# EAGLE design Main Board (rev A) - hand solder (EAGLE 6.4)
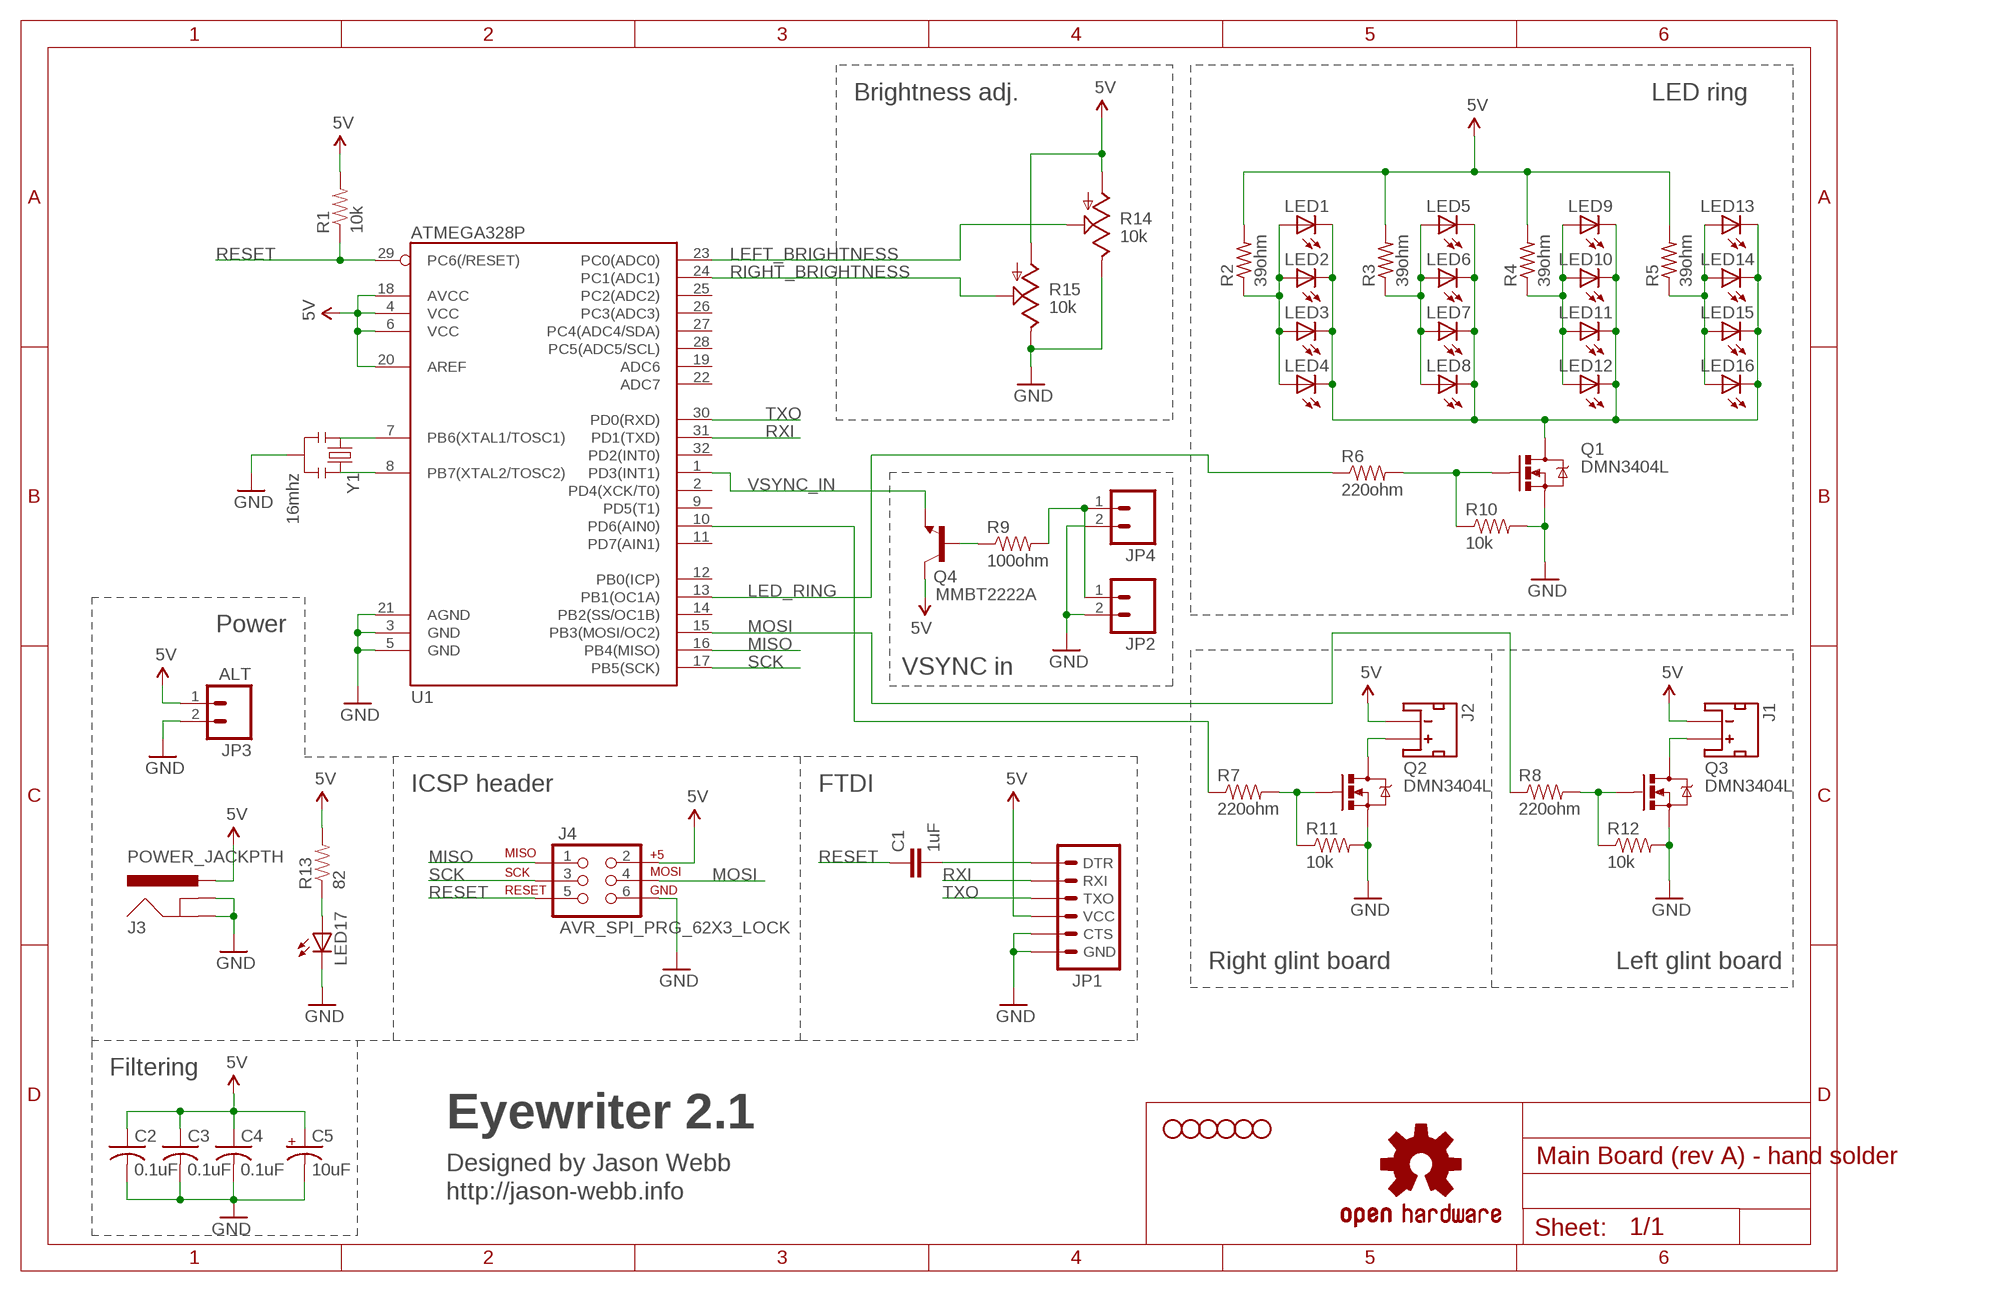
[diagram p0: schematic, sheet 1]

## Parts
C1  1uF  CAP0805  [0805]
C2  0.1uF  C-USC0805K  [C0805K]
C3  0.1uF  C-USC0805K  [C0805K]
C4  0.1uF  C-USC0805K  [C0805K]
C5  10uF  CPOL-USA/3216-18R  [A/3216-18R]
J1  JST_2MM_MALE  [JST-2-SMD]
J2  JST_2MM_MALE  [JST-2-SMD]
J3  POWER_JACKPTH  [POWER_JACK_PTH]
J4  AVR_SPI_PRG_62X3_LOCK  [2X3_LOCK]
JP1  ARDUINO_SERIAL_PROGRAMLOCK  [1X06_LOCK]
JP2  M02PTH  [1X02]
JP3  ALT  M02PTH  [1X02]
JP4  M02PTH  [1X02]
LED1  LED5MM  [LED5MM]
LED2  LED5MM  [LED5MM]
LED3  LED5MM  [LED5MM]
LED4  LED5MM  [LED5MM]
LED5  LED5MM  [LED5MM]
LED6  LED5MM  [LED5MM]
LED7  LED5MM  [LED5MM]
LED8  LED5MM  [LED5MM]
LED9  LED5MM  [LED5MM]
LED10  LED5MM  [LED5MM]
LED11  LED5MM  [LED5MM]
LED12  LED5MM  [LED5MM]
LED13  LED5MM  [LED5MM]
LED14  LED5MM  [LED5MM]
LED15  LED5MM  [LED5MM]
LED16  LED5MM  [LED5MM]
LED17  LEDCHIPLED_0805  [CHIPLED_0805]
LOGO1  OSHW-LOGOS  [OSHW-LOGO-S]
Q1  DMN3404L  MOSFET-NCHANNELSMD  [SOT23-3]
Q2  DMN3404L  MOSFET-NCHANNELSMD  [SOT23-3]
Q3  DMN3404L  MOSFET-NCHANNELSMD  [SOT23-3]
Q4  MMBT2222A  TRANSISTOR_NPNSOT23  [SOT23]
R1  10k  RESISTOR0805-RES  [0805]
R2  39ohm  R-US_0309/10  [0309/10]
R3  39ohm  R-US_0309/10  [0309/10]
R4  39ohm  R-US_0309/10  [0309/10]
R5  39ohm  R-US_0309/10  [0309/10]
R6  220ohm  RESISTOR0805-RES  [0805]
R7  220ohm  RESISTOR0805-RES  [0805]
R8  220ohm  RESISTOR0805-RES  [0805]
R9  100ohm  RESISTOR0805-RES  [0805]
R10  10k  RESISTOR0805-RES  [0805]
R11  10k  RESISTOR0805-RES  [0805]
R12  10k  RESISTOR0805-RES  [0805]
R13  82  RESISTOR0805-RES  [0805]
R14  10k  POT  [ALPS_POT]
R15  10k  POT  [ALPS_POT]
STANDOFF1  STAND-OFF  [STAND-OFF]
STANDOFF2  STAND-OFF  [STAND-OFF]
STANDOFF3  STAND-OFF  [STAND-OFF]
STANDOFF4  STAND-OFF  [STAND-OFF]
STANDOFF5  STAND-OFF  [STAND-OFF]
STANDOFF6  STAND-OFF  [STAND-OFF]
U1  ATMEGA328P  ATMEGA328_SMT  [TQFP32-08]
Y1  16mhz  RESONATORPTH  [RESONATOR-PTH]

## Nets
5V: C2.1 C3.1 C4.1 C5.+ J1.1(-) J2.1(-) J3.PWR J4.2 JP1.4(VCC) JP3.1 Q4.3(C) R1.2 R2.2 R3.2 R4.2 R5.2 R13.2 R14.P$3(A) R15.P$3(A) U1.4(VCC) U1.6(VCC) U1.18(AVCC) U1.20(AREF)
GLINT_RIGHT: R8.1 U1.15(PB3(MOSI/OC2))
GND: C2.2 C3.2 C4.2 C5.- J3.GND J3.GNDBREAK J4.6 JP1.5(CTS) JP1.6(GND) JP2.2 JP3.2 JP4.2 LED17.C Q1.2(S) Q2.2(S) Q3.2(S) R10.2 R11.2 R12.2 R14.P$1(E) R15.P$1(E) U1.3(GND) U1.5(GND) U1.21(AGND) Y1.2
LED_RING: R6.1 U1.13(PB1(OC1A))
LEFT_BRIGHTNESS: R14.P$2(S) U1.23(PC0(ADC0))
MISO: J4.1 U1.16(PB4(MISO))
MOSI: J4.4 R7.1 U1.10(PD6(AIN0))
N$1: LED17.A R13.1
N$2: U1.7(PB6(XTAL1/TOSC1)) Y1.1
N$3: U1.8(PB7(XTAL2/TOSC2)) Y1.3
N$4: LED1.A LED2.A LED3.A LED4.A R2.1
N$5: J2.2(+) Q2.3(D)
N$6: LED5.A LED6.A LED7.A LED8.A R3.1
N$7: Q1.1(G) R6.2 R10.1
N$8: LED9.A LED10.A LED11.A LED12.A R4.1
N$9: Q2.1(G) R7.2 R11.1
N$10: LED13.A LED14.A LED15.A LED16.A R5.1
N$11: J1.2(+) Q3.3(D)
N$12: JP2.1 JP4.1 R9.2
N$13: LED1.K(C) LED2.K(C) LED3.K(C) LED4.K(C) LED5.K(C) LED6.K(C) LED7.K(C) LED8.K(C) LED9.K(C) LED10.K(C) LED11.K(C) LED12.K(C) LED13.K(C) LED14.K(C) LED15.K(C) LED16.K(C) Q1.3(D)
N$14: Q3.1(G) R8.2 R12.1
N$15: Q4.1(B) R9.1
N$16: C1.2 JP1.1(DTR)
RESET: C1.1 J4.5 R1.1 U1.29(PC6(/RESET))
RIGHT_BRIGHTNESS: R15.P$2(S) U1.24(PC1(ADC1))
RXI: JP1.2(RXI) U1.31(PD1(TXD))
SCK: J4.3 U1.17(PB5(SCK))
TXO: JP1.3(TXO) U1.30(PD0(RXD))
VSYNC_IN: Q4.2(E) U1.1(PD3(INT1))
Unconnected: J1.NC1(PAD1) J1.NC2(PAD2) J2.NC1(PAD1) J2.NC2(PAD2) U1.2(PD4(XCK/T0)) U1.9(PD5(T1)) U1.11(PD7(AIN1)) U1.12(PB0(ICP)) U1.14(PB2(SS/OC1B)) U1.19(ADC6) U1.22(ADC7) U1.25(PC2(ADC2)) U1.26(PC3(ADC3)) U1.27(PC4(ADC4/SDA)) U1.28(PC5(ADC5/SCL)) U1.32(PD2(INT0))

## Notes on the sheet
- Brightness adj. | LED ring
- Power
- VSYNC in
- ICSP header | FTDI
- Right glint board | Left glint board
- Filtering
- Eyewriter 2.1
- Designed by Jason Webb
- http://jason-webb.info

## Library data of the parts
C1 = SparkFun-Capacitors:CAP: Capacitor Standard 0603 ceramic capacitor, and 0.1" leaded capacitor.
C2-C4 = adafruit:C-US: CAPACITOR, American symbol
C5 = adafruit:CPOL-US: POLARIZED CAPACITOR, American symbol
J1 J2 = SparkFun-Connectors:JST_2MM_MALE: Mates to single-cell LiPo batteries. CONN-08352; PROD_ID: CONN-08352
J3 = SparkFun-Connectors:POWER_JACK: Power Jack This is the standard 5.5mm barrel jack for power. The PTH is the most common, proven, reliable, footprint. The Slot footprint only works if the mill layer is transmitted to the PCB fab house so be warned. Spark Fun Electronics SKU : PRT-00119 SMT: CONN-08106 Mating wall wart : TOL-00298 (and others)
J4 = SparkFun-Connectors:AVR_SPI_PRG_6: AVR ISP 6 Pin This is the reduced ISP connector for AVR programming. Common on Arduino. This footprint will take up less PCB space and can be used with a 10-pin to 6-pin adapter such as SKU: BOB-08508
JP1 = SparkFun-Connectors:ARDUINO_SERIAL_PROGRAM: FTDI connector footprints
JP2-JP4 = SparkFun-Connectors:M02: Header 2 Standard 2-pin 0.1" header. Use with straight break away headers (SKU : PRT-00116), right angle break away headers (PRT-00553), swiss pins (PRT-00743), machine pins (PRT-00117), and female headers (PRT-00115). Molex polarized connector foot print use with SKU : PRT-08233 with associated crimp pins and housings.
LED1-LED16 = SparkFun-LED:LED: LEDs Standard schematic elements and footprints for 5mm, 3mm, 1206, and 0603 sized LEDs. 5mm - Spark Fun Electronics SKU : COM-00529 (and others)
LED17 = led:LED: LED OSRAM: - CHIPLED LG R971, LG N971, LY N971, LG Q971, LY Q971, LO R971, LY R971 LH N974, LH R974 LS Q976, LO Q976, LY Q976 LO Q996 - Hyper CHIPLED LW Q18S LB Q993, LB Q99A, LB R99A - SideLED LS A670, LO A670, LY A670, LG A670, LP A670 LB A673, LV A673, LT A673, LW A673 LH A674 LY A675 LS A676, LA A676, LO A676, LY A676, LW A676 LS A679, LY A679, LG A679 - Hyper Micro SIDELED® LS Y876, LA Y876, LO Y876, LY Y876 LT Y87S - SmartLED LW L88C, LW L88S LB L89C, LB L89S, LG L890 LS L89K, LO L89K, LY L89K LS L896, LA L896, LO L896, LY L896 - TOPLED LS T670, LO T670, LY T670, LG T670, LP T670 LSG T670, LSP T670, LSY T670, LOP T670, LYG T670 LG T671, LOG T671, LSG T671 LB T673, LV T673, LT T673, LW T673 LH T674 LS T676, LA T676, LO T676, LY T676, LB T676, LH T676, LSB T676, LW T676 LB T67C, LV T67C, LT T67C, LS T67K, LO T67K, LY T67K, LW E67C LS E67B, LA E67B, LO E67B, LY E67B, LB E67C, LV E67C, LT E67C LW T67C LS T679, LY T679, LG T679 LS T770, LO T770, LY T770, LG T770, LP T770 LB T773, LV T773, LT T773, LW T773 LH T774 LS E675, LA E675, LY E675, LS T675 LS T776, LA T776, LO T776, LY T776, LB T776 LHGB T686 LT T68C, LB T68C - Hyper Mini TOPLED® LB M676 - Mini TOPLED Santana® LG M470 LS M47K, LO M47K, LY M47K Source: http://www.osram.convergy.de LUXEON: - LUMILED® LXK2-PW12-R00, LXK2-PW12-S00, LXK2-PW14-U00, LXK2-PW14-V00 LXK2-PM12-R00, LXK2-PM12-S00, LXK2-PM14-U00 LXK2-PE12-Q00, LXK2-PE12-R00, LXK2-PE12-S00, LXK2-PE14-T00, LXK2-PE14-U00 LXK2-PB12-K00, LXK2-PB12-L00, LXK2-PB12-M00, LXK2-PB14-N00, LXK2-PB14-P00, LXK2-PB14-Q00 LXK2-PR12-L00, LXK2-PR12-M00, LXK2-PR14-Q00, LXK2-PR14-R00 LXK2-PD12-Q00, LXK2-PD12-R00, LXK2-PD12-S00 LXK2-PH12-R00, LXK2-PH12-S00 LXK2-PL12-P00, LXK2-PL12-Q00, LXK2-PL12-R00 Source: www.luxeon.com KINGBRIGHT: KA-3528ASYC Source: www.kingbright.com
LOGO1 = SparkFun-Aesthetics:OSHW-LOGO: Open Source Hardware Logo This logo indicates the piece of hardware it is found on incorporates a OSHW license and/or adheres to the definition of open source hardware found here: http://freedomdefined.org/OSHW
Q1-Q3 = SparkFun-DiscreteSemi:MOSFET-NCHANNEL: Generic NMOS footprint
Q4 = SparkFun-DiscreteSemi:TRANSISTOR_NPN: Generic NPN BJT. MMBT2222 is the common NPN we use. Double check against datasheet- not all devices are the same!
R1 R6-R13 = SparkFun-Resistors:RESISTOR: Resistor Basic schematic elements and footprints for 0603, 1206, and PTH resistors.
R2-R5 = resistor:R-US_: RESISTOR, American symbol
R14 R15 = SparkFun-Electromechanical:POT
STANDOFF1-STANDOFF6 = SparkFun-Electromechanical:STAND-OFF: #4 Stand Off This is the mechanical footprint for a #4 phillips button head screw. Use the keepout ring to avoid running the screw head into surrounding components. SKU : PRT-00447
U1 = SparkFun-DigitalIC:ATMEGA328_SMT: 32-Pin Atmega328 part Commonly used on Arduino compatible boards Available in QFP and QFN packages TQFP is IC-09069 QFN is non-stock; PROD_ID: IC-09069
Y1 = SparkFun-FreqCtrl:RESONATOR: Resonator Small SMD resonator. Used, eg, on the Arduino Pro/ Pro Mini boards. 8MHz- XTAL-08895 16MHz- XTAL-08900

## Board
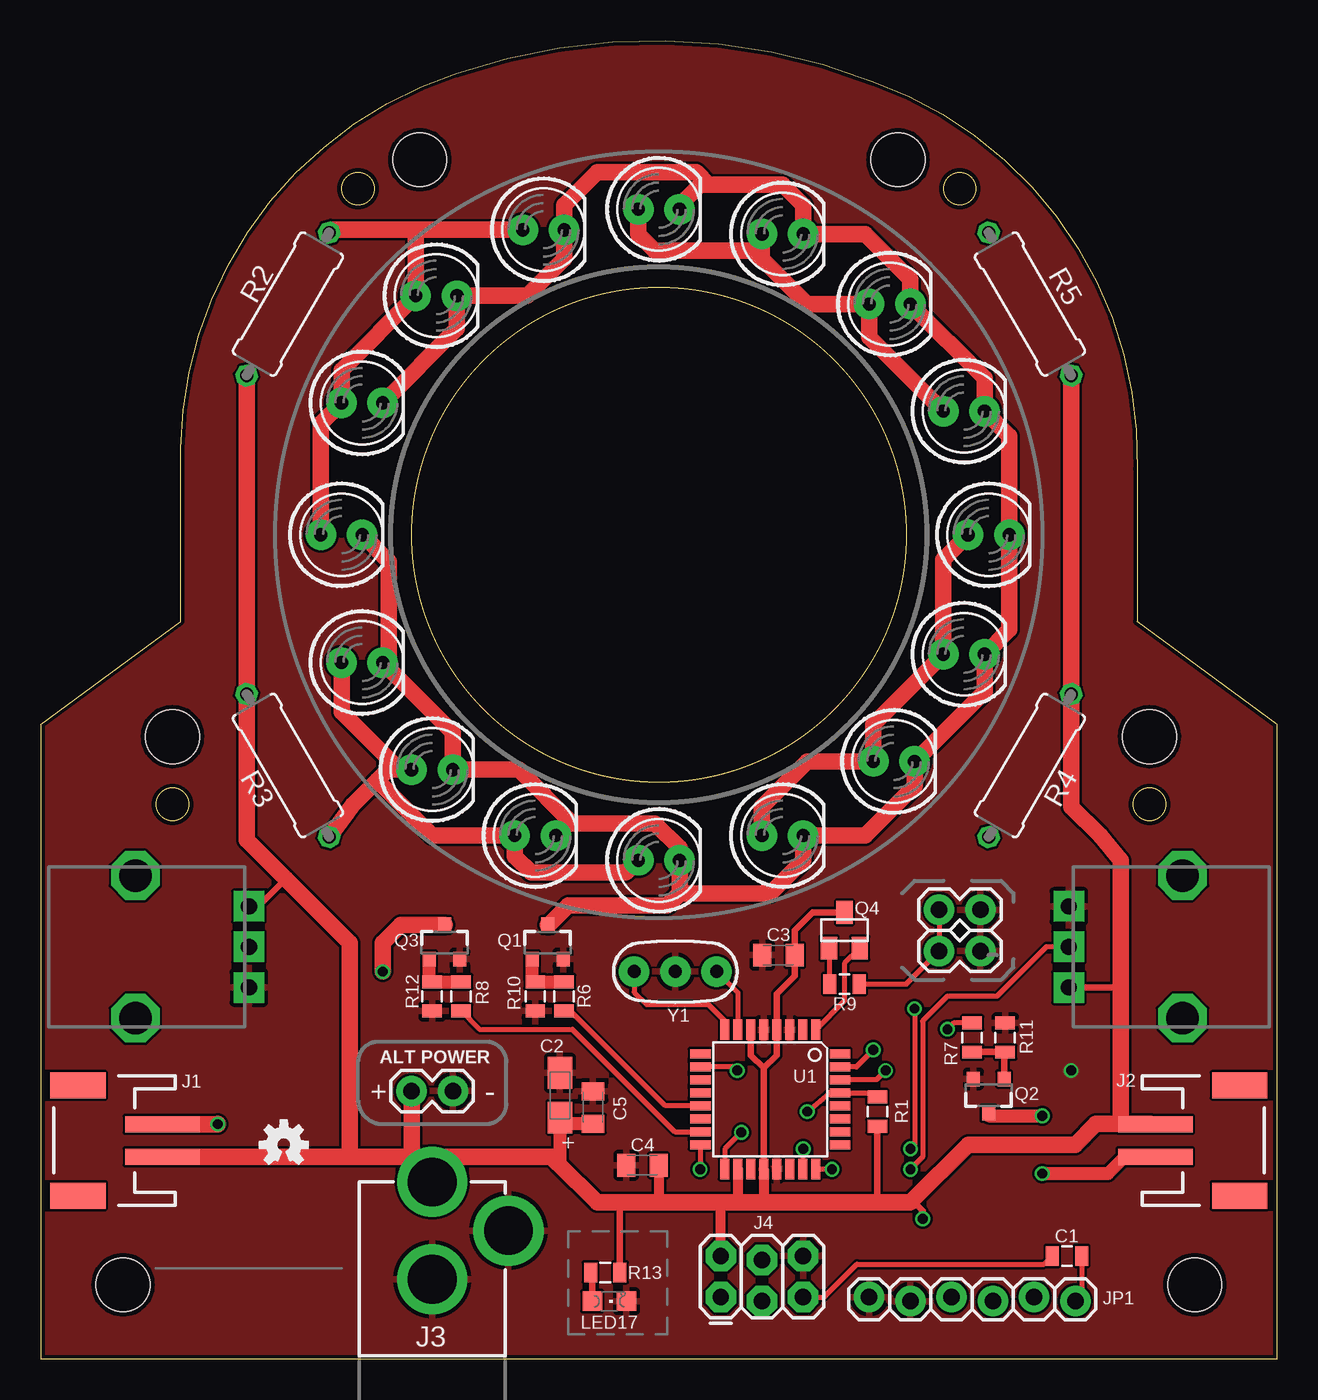
[diagram p1: board, top side]
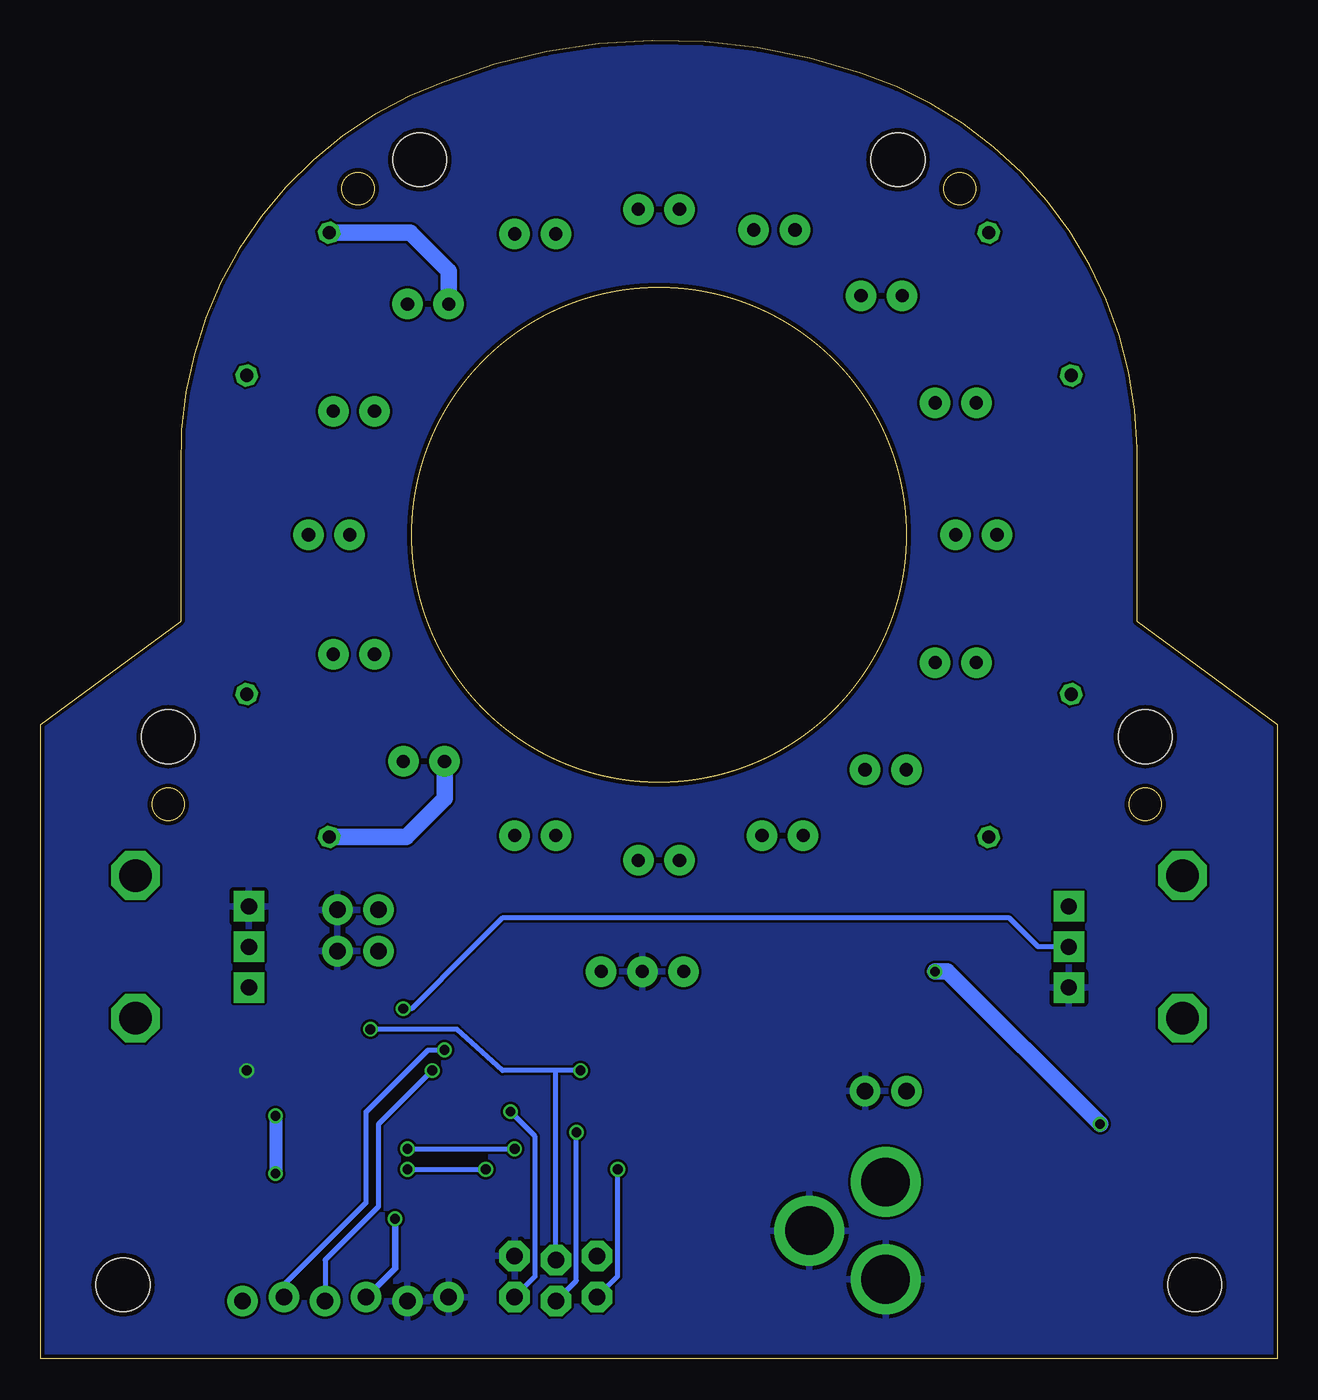
[diagram p2: board, bottom side, seen from below]

Size 76.2 x 81.26 mm. Coordinates in mm from the lower left corner, seen from the top.
Outline: 0,0 76.2,0 76.2,39.12 67.56,45.47 67.56,54.86 arc72 51.31,78.74 arc40 25.65,79.25 arc71 8.64,56.13 8.64,45.47 0,39.12 0,0
Outline: circle at 38.1,50.8 radius 15.24
Outline: circle at 8.13,34.19 radius 1
Outline: circle at 68.33,34.19 radius 1
Outline: circle at 19.56,72.14 radius 1
Outline: circle at 56.64,72.14 radius 1
Copper layers (1*16): Top 0.035mm / dielectric 1.5mm / Bottom 0.035mm
Design rules "Fusion_eagle_rule_v1.1": minimum track width 6mil, minimum drill 12mil, track to track 6mil, track to pad 6mil, pad to pad 6mil, via to via 6mil, smd to smd 0mil, copper to edge 10mil, drill to drill 10mil, minimum pad ring 10mil, minimum via ring 6mil, stop-mask expansion 2mil, vias tented up to drill 100mil, thermal gap 10mil

### Footprints (pad centres in the part's own frame; a part is rotated, then mirrored left to right if it is on the bottom)
0805 = smd 0.8 x 1.2: 1 -0.9,0; 2 0.9,0
C0805K = smd 1.1 x 1.4: 1 -1,0; 2 1,0
A/3216-18R = smd 1.95 x 1.5: + 1.375,0; - -1.375,0
JST-2-SMD = smd 1 x 4.6: 1 -1,-3.7; 2 1,-3.7 | smd 1.6 x 3.4: NC1 -3.4,1.5; NC2 3.4,1.5
POWER_JACK_PTH = drill 2.997 pad 4.318: GND 0,7.7; GNDBREAK 4.7,10.7; PWR 0,13.7
2X3_LOCK = drill 1.016 pad 1.88 octagon: 1 0,0; 2 0,2.54; 3 2.54,-0.254; 4 2.54,2.286; 5 5.08,0; 6 5.08,2.54
1X06_LOCK = drill 1.016 pad 1.88: 1 0,0; 2 2.54,-0.254; 3 5.08,0; 4 7.62,-0.254; 5 10.16,0; 6 12.7,-0.254
1X02 = drill 1.016 pad 1.88: 1 0,0; 2 2.54,0
LED5MM = drill 0.813 pad 1.88: A -1.27,0; K 1.27,0
CHIPLED_0805 = smd 1.2 x 1.2: A 0,-1.05; C 0,1.05
SOT23-3 = smd 0.8 x 0.9: 1 -0.95,-1; 2 0.95,-1; 3 0,1.1
SOT23 = smd 1 x 1.4: 1 -0.95,-1.1; 2 0.95,-1.1; 3 0,1.1
0309/10 = drill 0.813 octagon: 1 -5.08,0; 2 5.08,0
ALPS_POT = drill 1 pad 1.88 square: P$1 7,-2.5; P$2 7,0; P$3 7,2.5 | drill 2 octagon: P$4 0,-4.4; P$5 0,4.4
STAND-OFF = hole 3.302: 0,0
TQFP32-08 = smd 1.27 x 0.559: 1 -4.293,2.8; 2 -4.293,2; 3 -4.293,1.2; 4 -4.293,0.4; 5 -4.293,-0.4; 6 -4.293,-1.2; 7 -4.293,-2; 8 -4.293,-2.8; 17 4.293,-2.8; 18 4.293,-2; 19 4.293,-1.2; 20 4.293,-0.4; 21 4.293,0.4; 22 4.293,1.2; 23 4.293,2; 24 4.293,2.8 | smd 0.559 x 1.27: 9 -2.8,-4.293; 10 -2,-4.293; 11 -1.2,-4.293; 12 -0.4,-4.293; 13 0.4,-4.293; 14 1.2,-4.293; 15 2,-4.293; 16 2.8,-4.293; 25 2.8,4.293; 26 2,4.293; 27 1.2,4.293; 28 0.4,4.293; 29 -0.4,4.293; 30 -1.2,4.293; 31 -2,4.293; 32 -2.8,4.293
RESONATOR-PTH = drill 0.8 pad 1.88: 1 -2.54,0; 2 0,0; 3 2.54,0

### Placement (x,y rotation side)
C1  63.25,6.35 0 top
C2  34.04,15.49 90 top
C3  45.47,24.89 180 top
C4  37.08,11.94 180 top
C5  32,16.26 270 top
J1  3.81,13.46 90 top
J2  72.39,13.46 270 top
J3  24.13,-2.79 0 top
J4  41.91,3.81 0 top
JP1  63.75,3.56 180 top
JP2  55.37,27.69 0 top
JP3  22.86,16.51 0 top
JP4  55.37,25.15 0 top
LED1  30.99,69.6 0 top
LED2  24.38,65.53 0 top
LED3  19.81,58.93 0 top
LED4  18.54,50.8 0 top
LED5  19.81,42.93 0 top
LED6  24.13,36.32 0 top
LED7  30.48,32.26 0 top
LED8  38.1,30.73 0 top
LED9  45.72,32.26 0 top
LED10  52.58,36.83 0 top
LED11  56.9,43.43 0 top
LED12  58.42,50.8 0 top
LED13  56.9,58.42 0 top
LED14  52.32,65.02 0 top
LED15  45.72,69.34 0 top
LED16  38.1,70.87 0 top
LED17  35.05,3.56 270 top
LOGO1  14.99,13.21 0 top
Q1  31.24,25.65 0 top
Q2  58.42,16.26 180 top
Q3  24.89,25.65 0 top
Q4  49.53,26.42 0 top
R1  51.56,15.24 270 top
R2  15.24,65.02 240 top
R3  15.24,36.58 120 top
R4  60.96,36.58 60 top
R5  60.96,65.02 300 top
R6  32.26,22.35 90 top
R7  57.4,19.81 270 top
R8  25.91,22.35 90 top
R9  49.53,23.11 0 top
R10  30.48,22.35 270 top
R11  59.44,19.81 90 top
R12  24.13,22.35 270 top
R13  34.8,5.33 0 top
R14  5.84,25.4 0 top
R15  70.36,25.4 180 top
STANDOFF1  5.08,4.57 0 top
STANDOFF2  71.12,4.57 0 top
STANDOFF3  23.37,73.91 0 top
STANDOFF4  52.83,73.91 0 top
STANDOFF5  8.13,38.35 0 top
STANDOFF6  68.33,38.35 0 top
U1  44.96,16 270 top
Y1  39.12,23.88 180 top

### Tracks (layer width: path | path; a pad name or v marks a point on that pad's centre or on a via)
5V  (via drill 0.6)
  Top 0.406: R1.2 51.56,9.91 51.31,9.65 | U1.6 43.76,18.73 44.56,17.93 | 44.56,17.93 44.56,11.18 | v54.36,8.64 54.36,9.14 53.72,9.78 | R13.2 35.7,9.51 35.56,9.65 | 44.56,17.93 45.36,18.73 U1.4 45.36,22.5 46.48,23.62 46.48,24.88 C3.1 46.48,24.91 46.48,26.42 47.58,27.52 Q4.3 | R14.P$3 13.42,27.9 15.11,29.59 | R15.P$3 66.51,22.9 66.55,22.86
  Top 0.61: J4.2 41.91,9.4 42.93,9.65 42.96,9.68 U1.18 | U1.20 44.56,11.18 44.56,9.76 44.45,9.65 | C4.1 38.08,9.92 38.35,9.65
  Top 0.813: 37.2,9.65 37.34,9.65 | J3.PWR 24.13,12.19 24.13,12.46 | 24.13,12.7 24.38,12.45 | C2.1 32.39,14.49 C5.+ 32,12.19 31.88,12.06
  Top 1.016: 66.55,14.48 65.02,14.48 63.75,13.21 57.15,13.21 53.72,9.78 53.59,9.65 51.31,9.65 44.45,9.65 42.93,9.65 38.35,9.65 37.34,9.65 35.56,9.65 34.29,9.65 31.88,12.06 31.5,12.45 24.38,12.45 24.13,12.19 | 66.55,14.48 68.42,14.48 J2.1 | 66.55,14.48 66.55,22.86 66.55,30.73 65.28,32.26 63.5,34.04 R4.2 R5.2 | J1.1 19.3,12.46 | 19.3,12.46 19.05,12.72 19.05,25.65 15.11,29.59 12.7,32 R3.2 R2.2 | 19.3,12.46 22.61,12.46 | 22.61,12.46 24.13,12.46 | R2.2 | JP3.1 22.86,12.72 22.61,12.46
  Bottom 0.406: v54.36,8.64 54.36,5.59 JP1.4
GLINT_RIGHT
  Top 0.305: R8.1 27.04,20.32 32.77,20.32 39.08,14 U1.15
GND  (via drill 0.6)
  other vias: 63.5,17.78
  pour Bottom: -0.51,-0.51 76.71,-0.51 76.71,81.79 -0.51,81.79
  pour Top: -0.51,-0.51 76.71,-0.51 76.71,81.79 -0.51,81.79
LED_RING
  Top 0.305: U1.13 38.5,15.6 32.65,21.45 R6.1
LEFT_BRIGHTNESS  (via drill 0.6 pad 0.61)
  Top 0.305: v53.59,12.95 53.85,13.21 v53.85,21.59 | v46.99,12.95 46.99,11.94 U1.23
  Bottom 0.305: v53.59,12.95 v46.99,12.95 | v53.85,21.59 53.34,21.59 49.66,25.27 49.53,25.4 47.75,27.18 16.51,27.18 14.73,25.4 R14.P$2
MISO  (via drill 0.6)
  Top 0.305: v40.64,11.68 40.66,11.71 U1.16
  Bottom 0.305: J4.1 40.64,5.08 v40.64,11.68
MOSI  (via drill 0.6)
  Top 0.305: v42.93,17.78 42.7,18 U1.10 | R7.1 56.27,20.71 v55.88,20.32
  Bottom 0.305: v42.93,17.78 44.45,17.78 | 44.45,17.78 47.75,17.78 50.55,20.32 v55.88,20.32 | J4.4 44.45,17.78
N$1
  Top 0.406: LED17.A 34,5.23 R13.1
N$2
  Top 0.305: Y1.1 42.96,22.57 U1.7
N$3
  Top 0.305: Y1.3 36.58,22.61 37.34,21.84 41.15,21.84 42.16,20.83 U1.8
N$4
  Top 1.016: LED4.A 17.27,57.66 LED3.A 18.54,60.96 LED2.A 23.11,69.6 | LED1.A 23.11,69.6 | 23.11,69.6 17.95,69.6 R2.1
N$5  (via drill 0.6)
  Top 0.813: v61.72,14.99 58.42,14.99 Q2.3 | 68.58,12.45 J2.2 68.67,12.45 66.8,12.45 65.79,11.43 v61.72,11.43
  Bottom 0.813: v61.72,14.99 v61.72,11.43
N$6
  Top 1.016: 20.74,35.65 21.42,36.32 22.1,36.32 | 22.1,36.32 LED6.A | LED5.A 18.54,39.88 22.1,36.32 | 20.74,35.65 24.13,32.26 LED7.A 29.21,30.99 30.23,29.97 36.07,29.97 LED8.A | R3.1 19.25,34.15 20.74,35.65
N$7
  Top 0.406: Q1.1 30.23,24.65
  Top 0.813: R6.2 R10.1 30.29,23.44 Q1.1
N$8
  Top 1.016: LED9.A 44.45,34.04 47.24,36.83 LED10.A 51.31,39.12 LED11.A 55.63,49.28 LED12.A
  Bottom 1.016: R4.1 53.67,32.18 51.31,34.54 LED10.A
N$9
  Top 0.406: Q2.1 59.37,18.85 R11.1 R7.2
N$10
  Top 1.016: LED13.A 51.05,62.99 LED14.A 47.24,65.02 44.45,67.82 | 44.45,67.82 LED15.A | LED16.A 36.83,69.34 37.85,68.33 43.94,68.33 44.45,67.82
  Bottom 1.016: R5.1 53.42,69.42 51.05,67.06 LED14.A
N$11  (via drill 0.6 pad 0.61)
  Top 1.016: J1.2 10.91,14.46 v10.92,14.48 | Q3.3 22.18,26.75 21.08,25.65 v21.08,23.88
  Bottom 1.016: v21.08,23.88 20.32,23.88 v10.92,14.48
N$12
  Top 0.305: R9.2 53.34,23.11 JP4.1 JP2.1
N$13
  Top 1.016: LED7.K 32.51,33.02 32.77,33.02 | 32.77,33.02 37.85,33.02 39.37,31.5 LED8.K 39.37,28.7 | 32.77,33.02 29.46,36.32 LED6.K 25.4,38.61 21.46,42.55 | LED5.K 21.46,42.55 | LED4.K 21.46,49.15 21.46,42.55 | LED16.K 39.37,71.12 40.64,72.39 41.15,72.39 | 41.15,72.39 45.72,72.39 46.99,71.12 LED15.K 50.8,69.34 53.59,66.55 LED14.K 58.17,60.45 LED13.K 59.69,56.9 LED12.K 59.69,44.96 LED11.K 58.17,41.15 LED10.K 53.85,35.31 50.8,32.26 LED9.K 46.99,30.73 44.96,28.7 39.37,28.7 | 41.15,72.39 40.39,73.15 34.29,73.15 32.26,71.12 LED1.K 32.26,67.82 29.97,65.53 LED2.K 25.65,63.5 LED3.K | Q1.3 31.33,26.75 32.51,27.94 38.61,27.94 39.37,28.7
N$14
  Top 0.813: Q3.1 23.94,23.44 R12.1 R8.2
N$15
  Top 0.305: Q4.1 48.58,23.16 R9.1
N$16
  Top 0.305: C1.2 64.15,3.95 JP1.1
RESET  (via drill 0.6)
  Top 0.305: v47.24,15.24 48.62,16.4 U1.29 51.3,16.4 R1.1 | J4.5 48.26,3.81 50.29,5.84 61.84,5.84 C1.1
  Bottom 0.305: J4.5 45.72,5.08 45.72,13.72 v47.24,15.24
RIGHT_BRIGHTNESS  (via drill 0.6 pad 0.61)
  Top 0.305: R15.P$2 61.98,25.4 58.93,22.35 55.88,22.35 54.36,20.83 54.36,12.45 v53.59,11.68 | v48.77,11.68 48.01,11.68 U1.24
  Bottom 0.305: v53.59,11.68 v48.77,11.68
RXI  (via drill 0.6)
  Top 0.305: v51.31,19.05 50.26,18 U1.31
  Bottom 0.305: v51.31,19.05 52.32,19.05 56.13,15.24 56.13,9.65 61.21,4.57 JP1.2
SCK  (via drill 0.6)
  Top 0.305: v43.18,13.97 42.16,12.95 U1.17
  Bottom 0.305: J4.3 43.18,4.83 v43.18,13.97
TXO  (via drill 0.6)
  Top 0.305: v52.07,17.78 51.49,17.2 U1.30
  Bottom 0.305: v52.07,17.78 55.37,14.48 55.37,9.4 58.67,6.1 JP1.3
VSYNC_IN
  Top 0.305: Q4.2 49.53,24.37 49.53,22.07 U1.1

### Text on the board
tPlace: ALT POWER | + | -
tDocu: EYEWRITER 2.1 | MAIN BOARD | GLINT | RING | BRIGHTNESS | BRIGHTNESS | GND | VSYNC | OSHW | Eyewriter 2.1 | POWER | Main board | <FTDI 5V> | Designed by | Jason Webb | http://jason-webb.info | MISO | SCK | RST | BLK | GRN | (REV A)